# Altium schematic sheet Power.SchDoc
size A
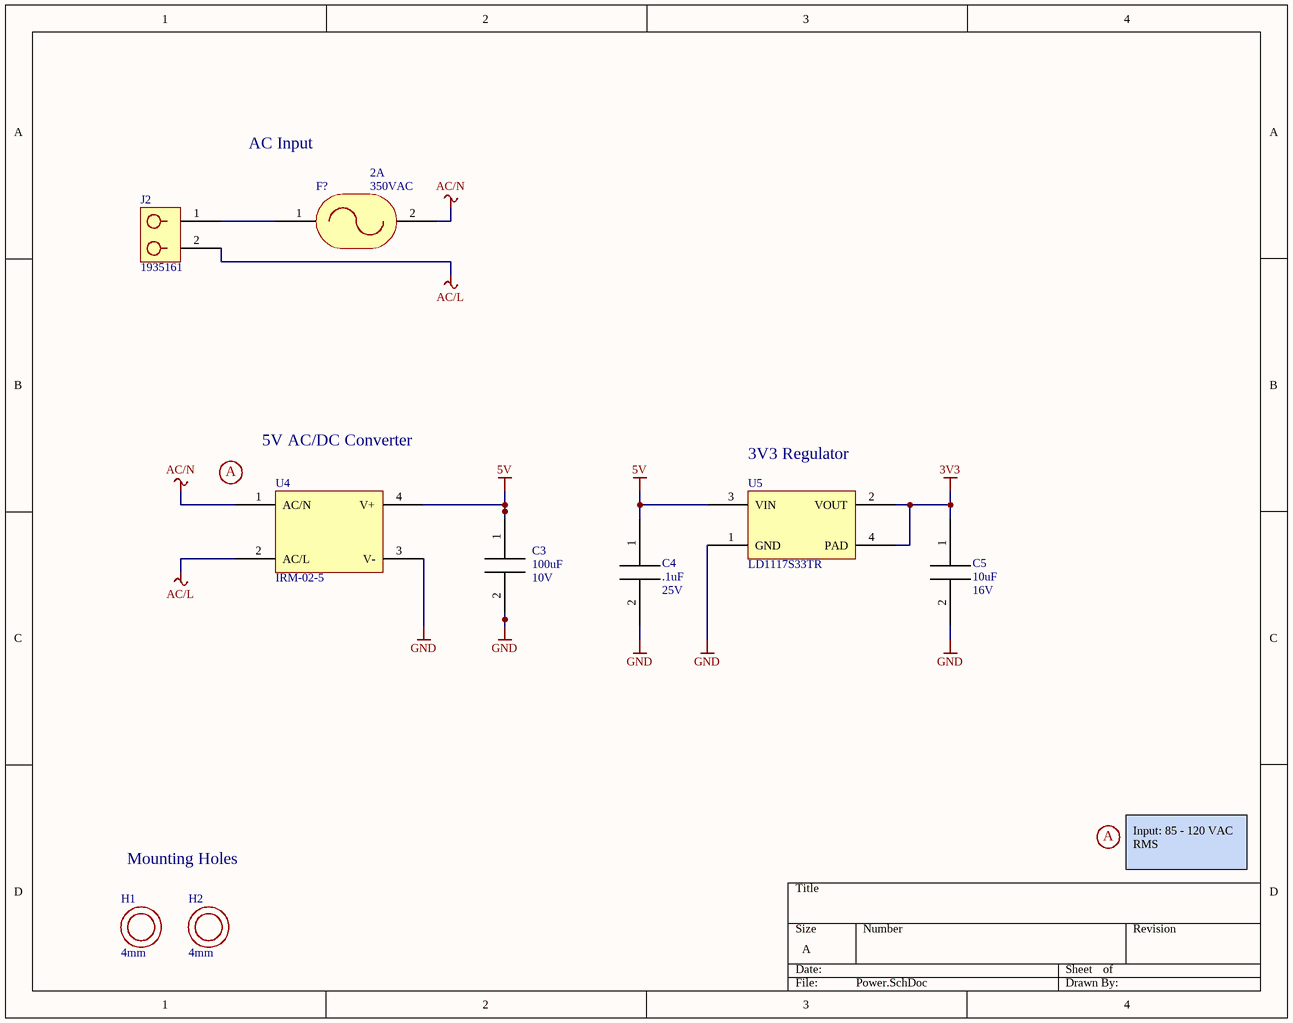
[diagram p0: Power.SchDoc]

## Parts
C3  value 100uF  Rating: 10V  [1206]  (hidden comment: CAP)
C4  value .1uF  Rating: 25V  [1206]  (hidden comment: CAP)
C5  value 10uF  Rating: 16V  [1206]  (hidden comment: CAP)
F?  value 2A  Rating: 350VAC  [0697H]  (hidden comment: F_FUSE_0697H)
H1  value 4mm  [MOUNTHOLE4MM]  (hidden comment: H_MOUNTHOLE_MOUNTHOLE4MM)
H2  value 4mm  [MOUNTHOLE4MM]  (hidden comment: H_MOUNTHOLE_MOUNTHOLE4MM)
J2  1935161  [1935161]
U4  IRM-02-5  [IRM-02-5]
U5  LD1117S33TR  [SOT223]

## Nets
3V3: C5.1 U5.2(VOUT) U5.4(PAD)
5V: C3.1 C4.1 U4.4(V+) U5.3(VIN)
AC/L: J2.2 U4.2(AC/L)
AC/N: F?.2 U4.1(AC/N)
GND: C3.2 C4.2 C5.2 U4.3(V-) U5.1(GND)
NetF?_1: F?.1 J2.1

## Notes on the sheet
- AC Input
- (near U4) A
- 5V AC/DC Converter
- (near U5) 3V3 Regulator
- A
- Mounting Holes
- Input: 85 - 120 VAC RMS

## Library data of the parts
C3-C5 = C_CAP_1206
J2 = J_2POSTERM_1935161
U4 = U_IRM-02-5_IRM-02-5
U5 = U_LD1117S33TR_SOT223